# Altium schematic sheet Control.SchDoc
size A4
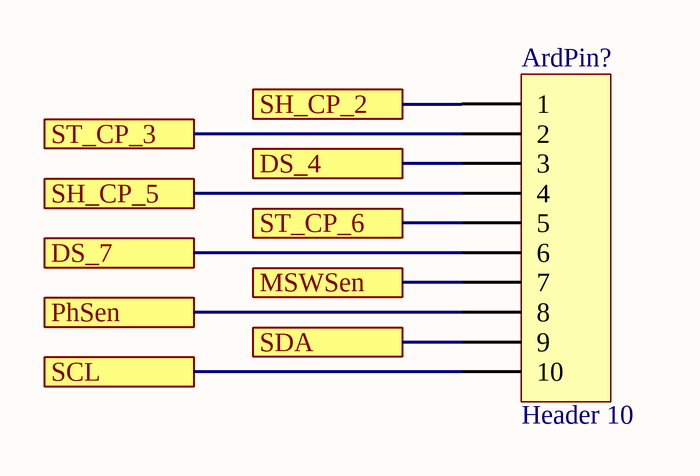
[diagram p0: Control.SchDoc]

## Parts
ArdPin?  Header 10  [HDR1X10]

## Ports
DS_4, DS_7, MSWSen, PhSen, SCL, SDA, SH_CP_2, SH_CP_5, ST_CP_3, ST_CP_6

## Nets
DS_4: ArdPin?.3 ; port DS_4
DS_7: ArdPin?.6 ; port DS_7
MSWSen: ArdPin?.7 ; port MSWSen
PhSen: ArdPin?.8 ; port PhSen
SCL: ArdPin?.10 ; port SCL
SDA: ArdPin?.9 ; port SDA
SH_CP_2: ArdPin?.1 ; port SH_CP_2
SH_CP_5: ArdPin?.4 ; port SH_CP_5
ST_CP_3: ArdPin?.2 ; port ST_CP_3
ST_CP_6: ArdPin?.5 ; port ST_CP_6

## Notes on the sheet
- Title
- Size:
- Date:
- A4
- Number:
- Time:
- Revision:
- Sheet
- of
- File:

## Library data of the parts
ArdPin? = Header 10: Header, 10-Pin; LatestRevisionDate: 17-Jul-2002; LatestRevisionNote: Re-released for DXP Platform.; Publisher: Altium Limited